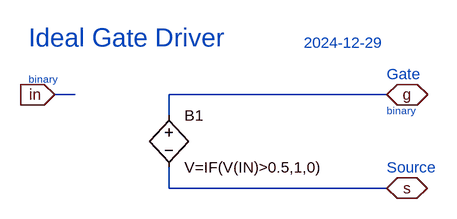
[diagram p0: schematic iGD.asc]
iGD.asc, the LTspice schematic file:
Version 4
SHEET 1 880 680
WIRE 80 64 48 64
WIRE 560 64 224 64
WIRE 224 96 224 64
WIRE 224 208 224 176
WIRE 560 208 224 208
FLAG 48 64 in
IOPIN 48 64 In
FLAG 560 64 g
IOPIN 560 64 BiDir
FLAG 560 208 s
IOPIN 560 208 BiDir
SYMBOL bv 224 80 R0
SYMATTR InstName B1
SYMATTR Value V=IF(V(IN)>0.5,1,0)
TEXT 8 -24 Left 4 ;Ideal Gate Driver
TEXT 8 40 Left 1 ;binary
TEXT 560 32 Left 2 ;Gate
TEXT 560 176 Left 2 ;Source
TEXT 560 88 Left 1 ;binary
TEXT 432 -16 Left 2 ;2024-12-29

The netlist it stands for:
* iGD.asc
B1 g s V=IF(V(IN)>0.5,1,0)
* Ideal Gate Driver
* binary
* Gate
* Source
* binary
* 2024-12-29
.backanno
.end